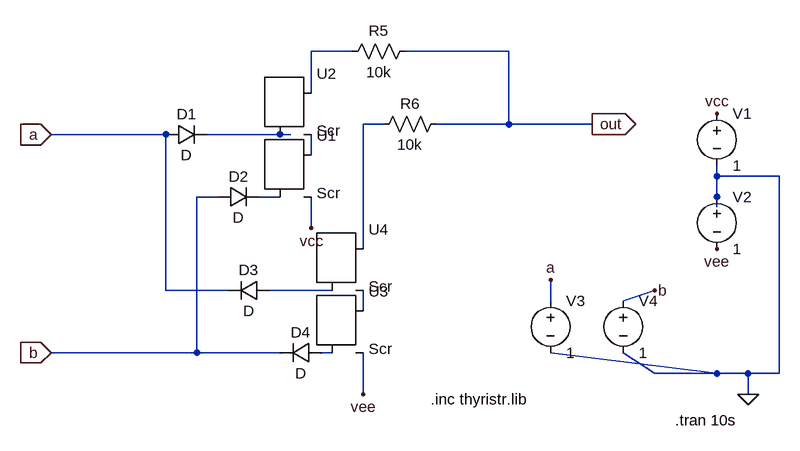
[diagram p0: schematic TANDTriac.asc]
TANDTriac.asc, the LTspice schematic file:
Version 4
SHEET 1 1456 680
WIRE -160 -448 -224 -448
WIRE 80 -448 -80 -448
WIRE -224 -384 -224 -448
WIRE -112 -336 -144 -336
WIRE 80 -336 80 -448
WIRE 80 -336 -32 -336
WIRE 208 -336 80 -336
WIRE -448 -320 -624 -320
WIRE -272 -320 -384 -320
WIRE -256 -320 -272 -320
WIRE -224 -288 -224 -320
WIRE 400 -256 400 -272
WIRE 496 -256 400 -256
WIRE -368 -224 -400 -224
WIRE -272 -224 -304 -224
WIRE 400 -224 400 -256
WIRE 400 -208 400 -224
WIRE -224 -176 -224 -224
WIRE -144 -144 -144 -336
WIRE -448 -80 -448 -320
WIRE -352 -80 -448 -80
WIRE -192 -80 -288 -80
WIRE 144 -64 144 -96
WIRE 256 -64 304 -80
WIRE -144 -48 -144 -80
WIRE -400 16 -400 -224
WIRE -400 16 -624 16
WIRE -272 16 -400 16
WIRE -192 16 -208 16
WIRE 304 48 256 16
WIRE 400 48 144 16
WIRE 400 48 304 48
WIRE 448 48 400 48
WIRE 496 48 496 -256
WIRE 496 48 448 48
WIRE -144 80 -144 16
WIRE 448 80 448 48
FLAG -144 80 vee
FLAG -624 -320 a
IOPIN -624 -320 In
FLAG -624 16 b
IOPIN -624 16 In
FLAG 208 -336 out
IOPIN 208 -336 Out
FLAG -224 -176 vcc
FLAG 448 80 0
FLAG 400 -352 vcc
FLAG 144 -96 a
FLAG 304 -80 b
FLAG 400 -144 vee
SYMBOL Res -64 -464 R90
WINDOW 0 0 56 VBottom 2
WINDOW 3 32 56 VTop 2
SYMATTR InstName R5
SYMATTR Value 10k
SYMBOL Res -16 -352 R90
WINDOW 0 0 56 VBottom 2
WINDOW 3 32 56 VTop 2
SYMATTR InstName R6
SYMATTR Value 10k
SYMBOL TRIAC -256 -288 R0
SYMATTR InstName U1
SYMATTR Value Scr
SYMBOL TRIAC -256 -384 R0
SYMATTR InstName U2
SYMATTR Value Scr
SYMBOL diode -448 -304 R270
WINDOW 0 32 32 VTop 2
WINDOW 3 0 32 VBottom 2
SYMATTR InstName D1
SYMBOL diode -368 -208 R270
WINDOW 0 32 32 VTop 2
WINDOW 3 0 32 VBottom 2
SYMATTR InstName D2
SYMBOL TRIAC -176 -48 R0
SYMATTR InstName U3
SYMATTR Value Scr
SYMBOL TRIAC -176 -144 R0
SYMATTR InstName U4
SYMATTR Value Scr
SYMBOL diode -288 -96 R90
WINDOW 0 0 32 VBottom 2
WINDOW 3 32 32 VTop 2
SYMATTR InstName D3
SYMBOL diode -208 0 R90
WINDOW 0 0 32 VBottom 2
WINDOW 3 32 32 VTop 2
SYMATTR InstName D4
SYMBOL voltage 400 -368 R0
SYMATTR InstName V1
SYMATTR Value 1
SYMBOL voltage 400 -240 R0
SYMATTR InstName V2
SYMATTR Value 1
SYMBOL voltage 144 -80 R0
SYMATTR InstName V3
SYMATTR Value 1
SYMBOL voltage 256 -80 R0
SYMATTR InstName V4
SYMATTR Value 1
TEXT 336 120 Left 2 !.tran 10s
TEXT -40 88 Left 2 !.inc thyristr.lib

The netlist it stands for:
* TANDTriac.asc
R5 out N001 10k
R6 out N002 10k
XU1 N004 N005 vcc Scr  ; pins MT2 G MT1
XU2 N001 N003 N004 Scr  ; pins MT2 G MT1
D1 a N003 D
D2 b N005 D
XU3 N007 N008 vee Scr  ; pins MT2 G MT1
XU4 N002 N006 N007 Scr  ; pins MT2 G MT1
D3 N006 a D
D4 N008 b D
V1 vcc 0 1
V2 0 vee 1
V3 a 0 1
V4 b 0 1
.model D D
.lib standard.dio
.tran 10s
.inc thyristr.lib
.backanno
.end